# EasyEDA Pro project ProPrj_fallctf2025badge_2025-09-24.epro, board badge-v0.3
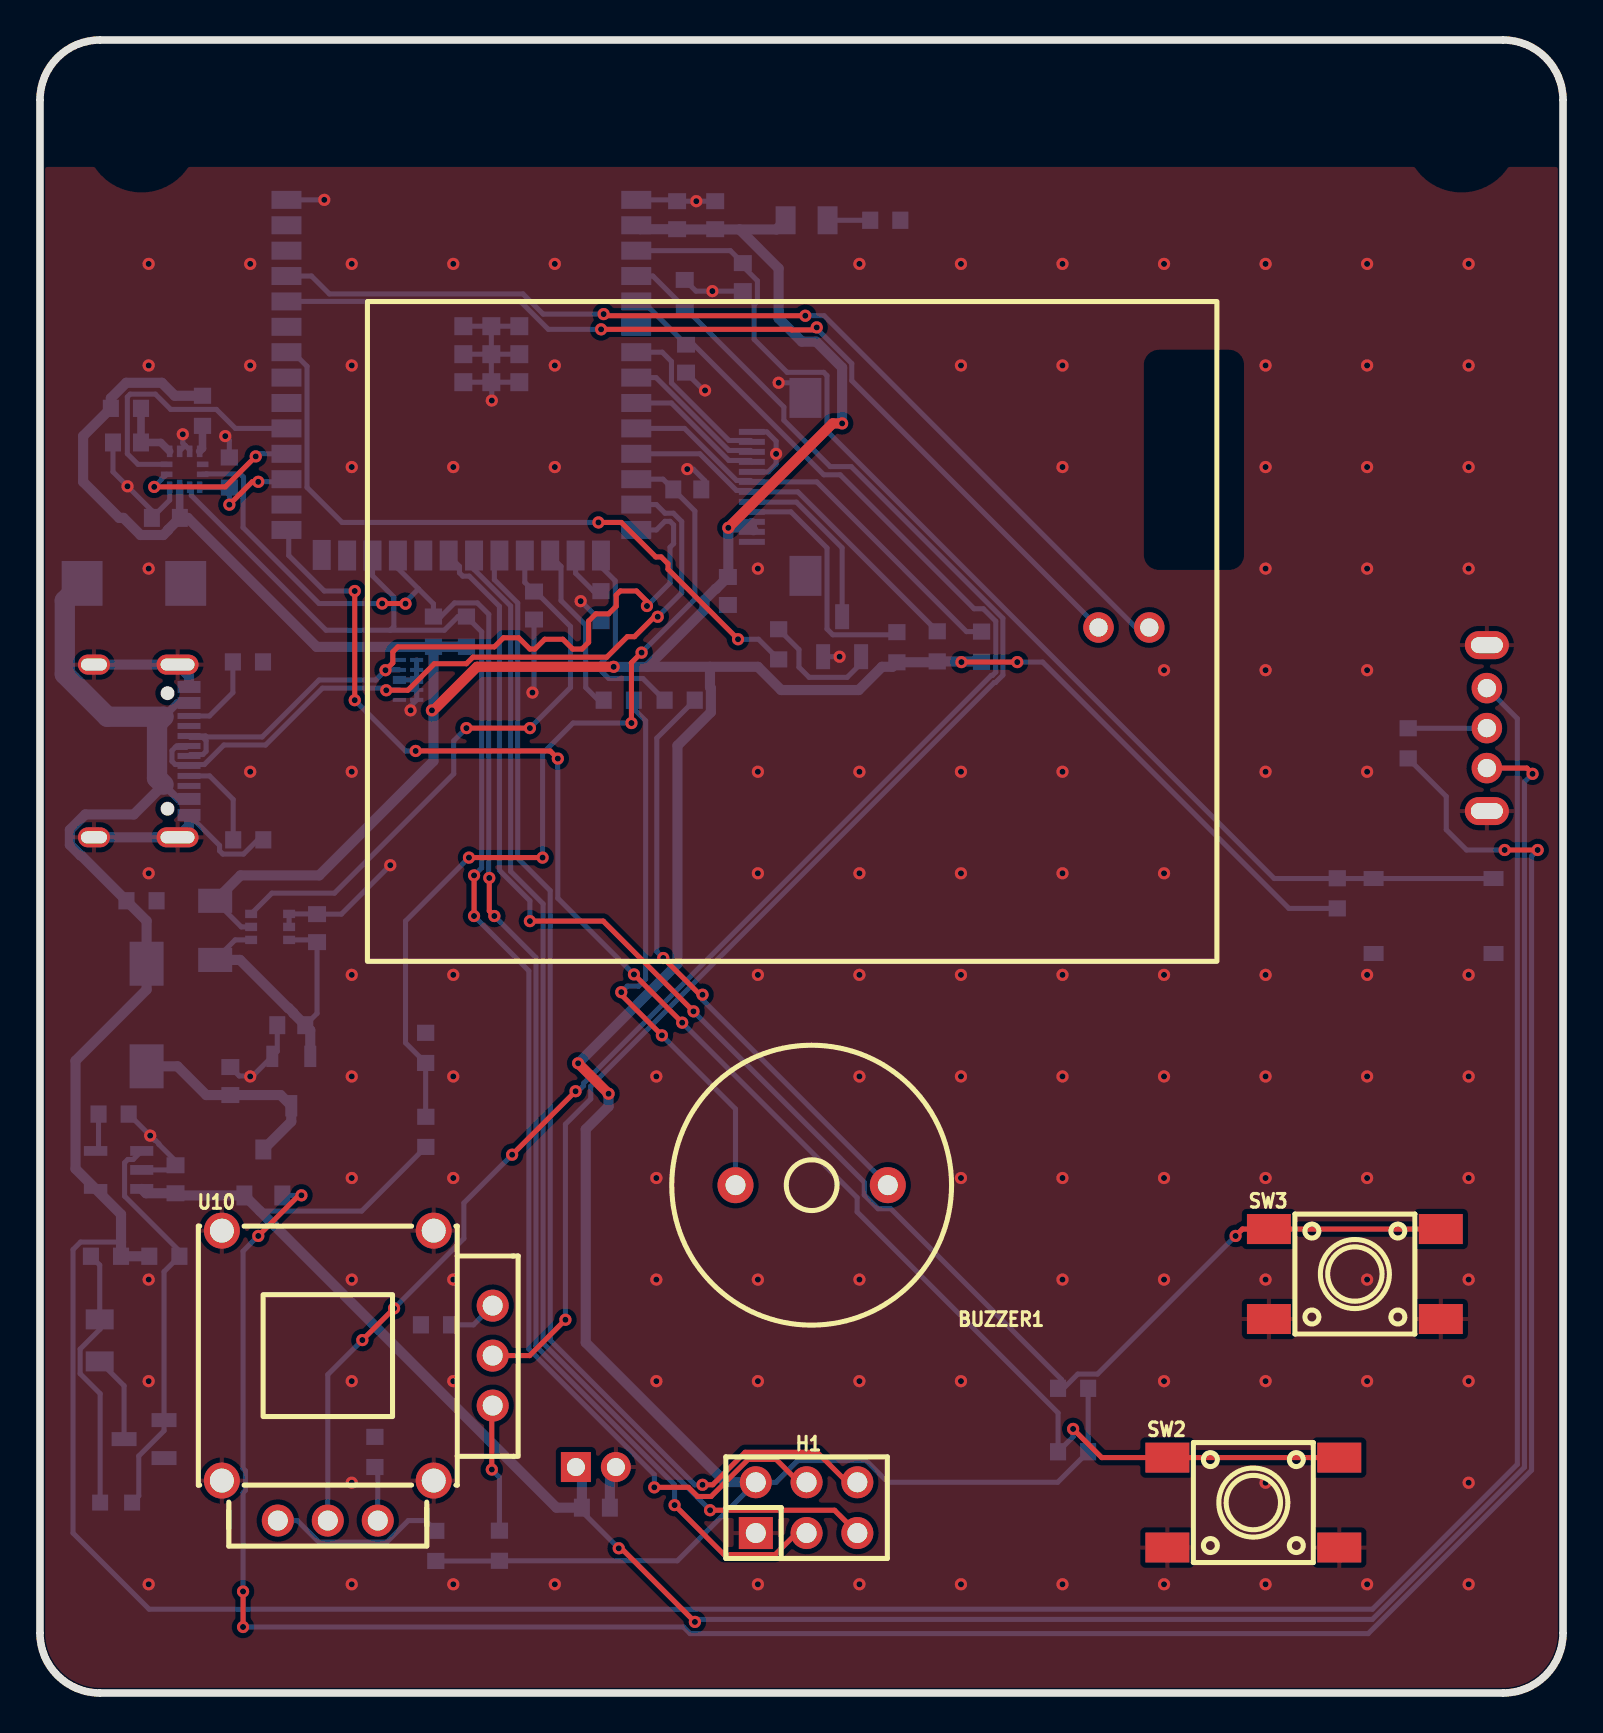
[diagram p17: board, top side]
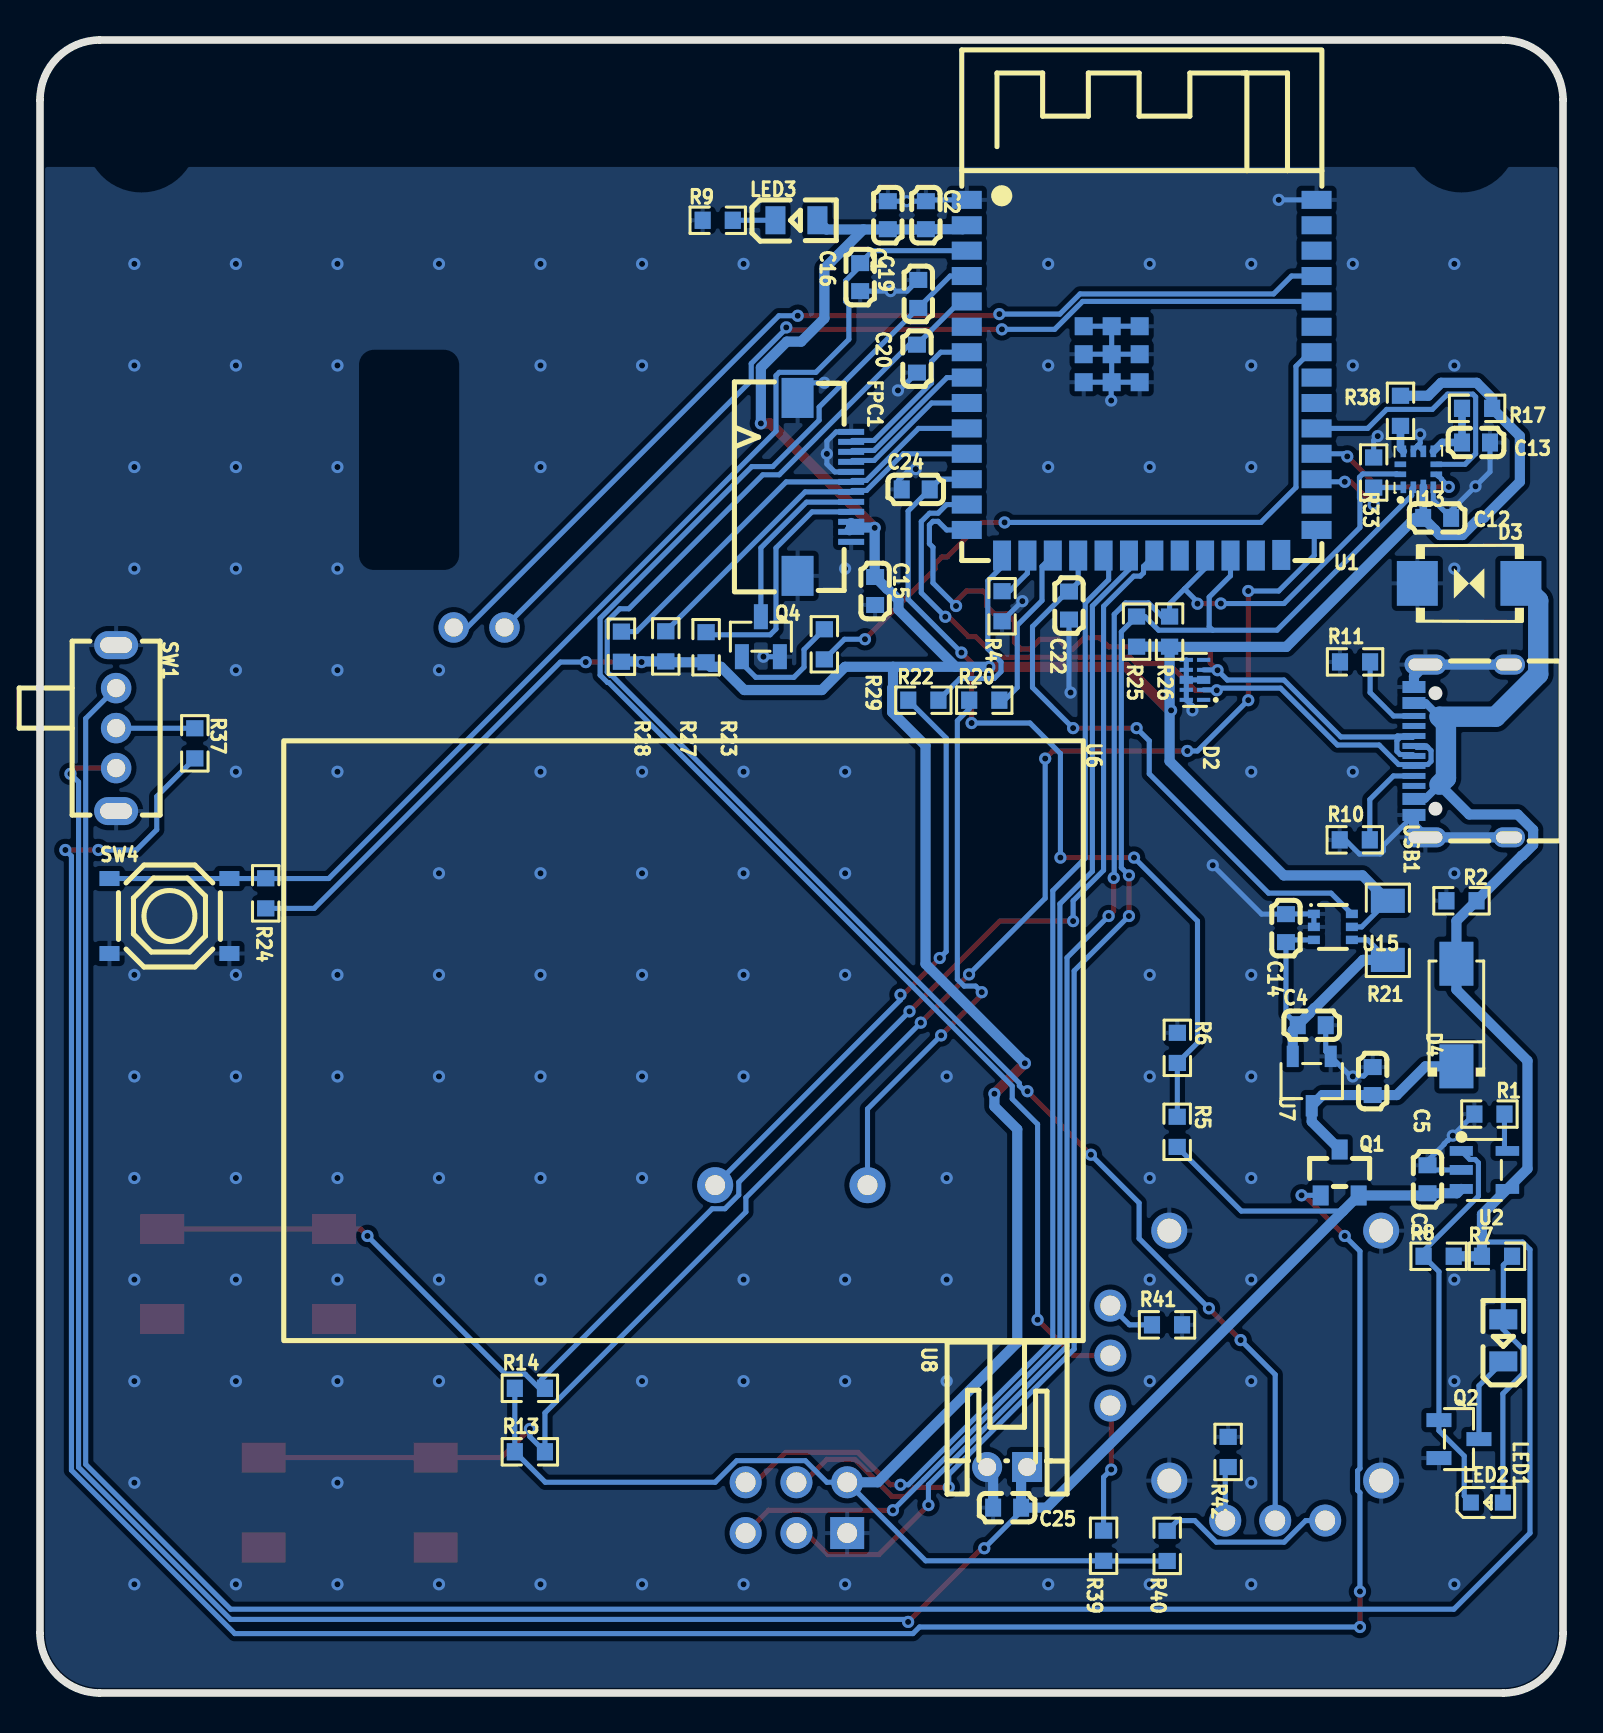
[diagram p18: board, bottom side, seen from below]

Outline 76.2 x 82.68 mm; copper layers: Top Layer, Bottom Layer. Coordinates in mm from the lower left corner of the outline.
Outline path: 0,79.68 0,3 arc(0.88,0.88) 3,0 73.2,0 arc(75.32,0.88) 76.2,3 76.2,79.68 arc(75.32,81.8) 73.2,82.68 3,82.68 arc(0.88,81.8) 0,79.68
Stack: Top Layer 0.035mm / Dielectric1 1.51mm FR4 er 4.5 / Bottom Layer 0.035mm

## Design rules (mm)
net D+: DP1
net D-: DP1
template: Custom Config
spacing copperThickness1oz (default): track to track 0.102, other pairs 0.152 to 0.3
spacing copperThickness2oz: track to track 0.203, other pairs 0.152 to 0.3
track width copperThickness1oz (default): min 0.127, default 0.254, max 2.54
track width copperThickness2oz: min 0.203, default 0.254, max 2.54
differential pair differentialPair (default): width min 0.127, default 0.254, max 2.54; gap min 0.152, default 0.152
via viaSize (default): diameter min 0.45, default 0.61, max 10; hole min 0.3, default 0.305, max 6.3

## Placement (name value [footprint] x y rotation side)
BUZZER1  4kHz  [BUZ-TH_BD14.0-P7.60-D0.7]  38.61 25.4 0 top
C1  22uF  [C0603]  33.78 73.91 90 bottom
C2  100nF  [C0603]  31.88 73.91 90 bottom
C3  1uF  [C0603]  6.78 25.7 90 bottom
C4  1uF  [C0603]  12.57 33.4 180 bottom
C5  1uF  [C0603]  9.53 30.61 90 bottom
C12  1uF  [C0603]  6.3 58.77 180 bottom
C13  1uF  [C0603]  4.35 62.55 180 bottom
C14  100nF  [C0603]  13.86 38.26 90 bottom
C15  100nF  [C0603]  34.42 55.12 270 bottom
C16  1uF  [C0603]  35.16 70.82 270 bottom
C19  100nF  [C0603]  32.26 69.98 270 bottom
C20  100nF  [C0603]  32.32 66.74 90 bottom
C22  100nF  [C0603]  24.72 54.39 90 bottom
C24  100nF  [C0603]  32.38 60.2 180 bottom
C25  100nF  [C0603]  27.81 9.27 0 bottom
D2  H5VU25U  [DFN2510-10_L2.5-W1.0-P0.50-BL]  18.41 50.67 90 bottom
D3  P6SMB6.8CA/TR13  [SMB_L4.6-W3.6-LS5.3-BI]  4.7 55.5 180 bottom
D4  SS14  [SMA_L4.2-W2.6-LS5.3-RD]  5.33 33.91 90 bottom
FPC1  AFC01-S12FCA-00  [FPC-SMD_AFC01-S12FCA-00]  36.96 60.32 270 bottom
H1  PM2.54-2*3  [HDR-TH_6P-P2.54-V-F-R2-C3-S2.54]  38.35 9.27 0 top
LED1  KT-0805G  [LED0805-R-RD]  2.99 17.64 90 bottom
LED2  KT-0603R  [LED0603-RD]  3.81 9.52 180 bottom
LED3  KT-0805G  [LED0805-R-RD]  38.35 73.66 180 bottom
Q1  AO3401A  [SOT-23_L2.9-W1.3-P1.90-LS2.4-BR]  11.18 26.03 270 bottom
Q2  AO3400A  [SOT-23-3_L2.9-W1.3-P1.90-LS2.4-BR]  5.21 12.7 0 bottom
Q4  AO3400A  [SOT-23-3_L2.9-W1.3-P1.90-LS2.4-BR]  40.13 52.83 270 bottom
R1  2.2K  [R0603]  3.68 28.96 0 bottom
R2  10K  [R0603]  5.08 39.62 180 bottom
R4  10K  [R0603]  28.07 54.36 90 bottom
R5  100K  [R0603]  19.3 28.07 270 bottom
R6  100K  [R0603]  19.3 32.27 270 bottom
R7  22K  [R0603]  3.3 21.84 0 bottom
R8  10K  [R0603]  6.22 21.84 180 bottom
R9  8.2K  [R0603]  42.29 73.66 180 bottom
R10  5K1  [R0603]  10.42 42.67 180 bottom
R11  5K1  [R0603]  10.41 51.57 180 bottom
R13  10K  [R0603]  51.69 12.06 180 bottom
R14  10K  [R0603]  51.69 15.24 180 bottom
R17  33  [R0603]  4.3 64.25 180 bottom
R20  220  [R0603]  28.96 49.66 0 bottom
R21  100mΩ  [R1206]  8.77 38.14 90 bottom
R22  220  [R0603]  32 49.66 0 bottom
R23  10  [R0603]  42.87 52.31 90 bottom
R24  10K  [R0603]  64.91 40 270 bottom
R25  5K1  [R0603]  21.34 53.09 270 bottom
R26  5K1  [R0603]  19.69 53.09 270 bottom
R27  10K  [R0603]  44.89 52.35 270 bottom
R28  10K  [R0603]  47.11 52.33 270 bottom
R29  220  [R0603]  36.96 52.45 90 bottom
R33  10K  [R0603]  9.47 61.04 270 bottom
R37  33  [R0603]  68.45 47.5 270 bottom
R38  10K  [R0603]  8.13 64.13 90 bottom
R39  8.2K  [R0603]  22.99 7.37 90 bottom
R40  8.2K  [R0603]  19.8 7.36 90 bottom
R41  820  [R0603]  19.81 18.41 180 bottom
R42  820  [R0603]  16.76 12.06 90 bottom
SW1  SK12D07VG4  [SW-TH_SK12D07VG4]  72.39 48.26 270 bottom
SW2  TS-1102S-C-C-B  [KEY-SMD_4P-L6.0-W6.0-P4.50-LS8.6]  60.71 9.52 0 top
SW3  TS-1102S-C-C-B  [KEY-SMD_4P-L6.0-W6.0-P4.50-LS8.6]  65.79 20.95 0 top
SW4  TS-1187A-B-A-B  [SW-SMD_4P-L5.1-W5.1-P3.70-LS6.5-TL_H1.5]  69.72 38.86 0 bottom
U1  2.4GHz  [WIRELM-SMD_ESP32-S3-WROOM-1]  21.08 65.79 180 bottom
U2  TP4054-42-SOT25R  [SOT-23-5_L3.0-W1.7-P0.95-LS2.8-BL]  3.94 26.16 270 bottom
U3  -  [pad_THT]  55.5 53.29 180 bottom
U4  -  [pad_THT]  52.96 53.29 180 bottom
U6  Battery  [lipo_battery]  45.34 32.64 270 bottom
U7  XC6206P332MR-G  [SOT-23-3_L2.9-W1.6-P1.90-LS2.8-BR]  12.57 30.61 90 bottom
U8  S2B-PH-K(LF)(SN)  [CONN-TH_S2B-PH-K-LF-SN]  27.81 11.3 180 bottom
U10  YA13-FL7.4-B5Ka(45-10)-R-Y06  [RES-ADJ-TH_YA13-FL7.4-B5KA-45-10-R-Y06_1]  15.88 15.88 0 top
U13  STK8321  [LGA-12_L2.0-W2.0-P0.50-TR]  7.24 61.2 0 bottom
U15  INA199A1DCKR  [SC-70-6_L2.2-W1.3-P0.65-LS2.1-BR]  11.51 38.32 0 bottom
U16  DISPLAY  [ER-TFT018-3]  38.1 53.72 0 top
USB1  HC-TYPE-C-16P-01A-L  [USB-C-SMD_G-SWITCH_GT-USB-7010EN]  5.08 47.12 90 bottom

## Footprints (pads in the part's own frame, mm; a bottom-side part is the same pattern mirrored in y, then rotated)
BUZ-TH_BD14.0-P7.60-D0.7
  round 1.8 hole 1: 1(-3.81,0) 2(3.81,0)
C0603
  rect 0.8x0.9 smd: 1(-0.7,0) 2(0.7,0)
CONN-TH_S2B-PH-K-LF-SN
  rect 1.5x1.5 hole 0.9: 1(1,0)
  round 1.5 hole 0.9: 2(-1,0)
DFN2510-10_L2.5-W1.0-P0.50-BL
  rect 0.2x0.665 smd: 1(-1,-0.433) 2(-0.5,-0.433) 4(0.5,-0.433) 5(1,-0.433) 6(1,0.433) 7(0.5,0.433) 9(-0.5,0.433) 10(-1,0.433)
  rect 0.4x0.665 smd: 3(0,-0.433) 8(0,0.433)
FPC-SMD_AFC01-S12FCA-00
  rect 0.3x1.3 smd: 1(-2.751,1.341) 2(-2.251,1.341) 3(-1.751,1.341) 4(-1.25,1.341) 5(-0.75,1.341) 6(-0.249,1.341) 7(0.251,1.341) 8(0.75,1.341) 9(1.249,1.341) 10(1.75,1.341) 11(2.249,1.341) 12(2.75,1.341)
  rect 2x1.6 smd: 13(-4.45,-1.34) 14(4.45,-1.341)
HDR-TH_6P-P2.54-V-F-R2-C3-S2.54
  rect 1.7x1.6 hole 1: 1(-2.54,-1.27)
  round 1.6 hole 1: 2(-2.54,1.27) 3(0,-1.27) 4(0,1.27) 5(2.54,-1.27) 6(2.54,1.27)
KEY-SMD_4P-L6.0-W6.0-P4.50-LS8.6
  rect 2.2x1.5 smd: 1(-4.3,2.25) 2(4.3,2.25) 3(-4.3,-2.25) 4(4.3,-2.25)
LED0603-RD
  rect 0.8x0.8 smd: 1(-0.799,0) 2(0.799,0)
LED0805-R-RD
  rect 1x1.399 smd: 1(1.05,0) 2(-1.05,0)
LGA-12_L2.0-W2.0-P0.50-TR
  rect 0.28x0.58 smd: 1(0.75,0.9) 2(0.25,0.9) 4(-0.75,0.9) 7(-0.75,-0.9) 8(-0.25,-0.9) 9(0.25,-0.9) 10(0.75,-0.9)
  rect 0.28x0.67 smd: 3(-0.25,0.855)
  rect 0.58x0.28 smd: 5(-0.9,0.25) 6(-0.9,-0.25) 11(0.9,-0.25) 12(0.9,0.25)
pad_THT
  round 1.524 hole 0.914: 1(0,0)
R0603
  rect 0.806x0.864 smd: 1(-0.753,0) 2(0.753,0)
R1206
  rect 1.208x1.701 smd: 1(-1.479,0) 2(1.479,0)
RES-ADJ-TH_YA13-FL7.4-B5KA-45-10-R-Y06_1
  round 1.6 hole 1: 1(6.775,3.5) 2(6.775,1) 3(6.775,-1.5) 4(1.025,-7.25) 5(-1.475,-7.25) 6(-3.975,-7.25)
  round 1.8 hole 1.2: 7(3.825,7.25) 7(3.825,-5.25) 8(-6.775,7.25) 8(-6.775,-5.25)
SC-70-6_L2.2-W1.3-P0.65-LS2.1-BR
  rect 0.6x0.42 smd: 1(0.95,-0.65) 2(0.95,0) 3(0.95,0.65) 4(-0.95,0.65) 5(-0.95,0) 6(-0.95,-0.65)
SMA_L4.2-W2.6-LS5.3-RD
  rect 2.2x1.7 smd: 1(-2.566,0) 2(2.566,0)
SMB_L4.6-W3.6-LS5.3-BI
  rect 2.047x2.241 smd: 1(-2.591,0) 2(2.591,0)
SOT-23-3_L2.9-W1.3-P1.90-LS2.4-BR
  rect 1.25x0.7 smd: 1(1,-0.95) 2(1,0.95) 3(-1,0)
SOT-23-3_L2.9-W1.6-P1.90-LS2.8-BR
  rect 1.07x0.6 smd: 1(1.235,-0.95) 2(1.235,0.95) 3(-1.235,0)
SOT-23-5_L3.0-W1.7-P0.95-LS2.8-BL
  rect 0.49x1.157 smd: 1(-0.95,-1.153) 2(0,-1.153) 3(0.95,-1.153)
  rect 0.49x1.175 smd: 4(0.95,1.153) 5(-0.95,1.153)
SOT-23_L2.9-W1.3-P1.90-LS2.4-BR
  rect 1x0.8 smd: 1(1.15,-0.95) 2(1.15,0.95) 3(-1.15,0)
SW-SMD_4P-L5.1-W5.1-P3.70-LS6.5-TL_H1.5
  rect 1x0.75 smd: 1(-3,1.875) 2(3,1.875) 3(-3,-1.875) 4(3,-1.875)
SW-TH_SK12D07VG4
  round 1.524 hole 0.914: 1(-2,0) 2(0,0) 3(2,0)
  oval 1.4x2.2 hole 0.8x1.6: 4(4.15,0) 5(-4.15,0)
USB-C-SMD_G-SWITCH_GT-USB-7010EN
  oval 1x2.1 hole 0.6x1.7: 1(-4.32,1.802) 2(4.32,1.802)
  oval 1x1.6 hole 0.6x1.3: 3(4.32,-2.377) 4(-4.32,-2.377)
  rect 0.6x1.15 smd: A1B12(-3.2,2.377) A4B9(-2.4,2.377) B1A12(3.2,2.377) B4A9(2.4,2.377)
  rect 0.3x1.15 smd: A5(-1.25,2.377) A6(-0.25,2.377) A7(0.25,2.377) A8(1.25,2.377) B5(1.75,2.377) B6(0.75,2.377) B7(-0.75,2.377) B8(-1.75,2.377)
WIRELM-SMD_ESP32-S3-WROOM-1
  rect 1.5x0.9 smd: 1(-8.75,8.895) 2(-8.75,7.625) 3(-8.75,6.355) 4(-8.75,5.085) 5(-8.75,3.815) 6(-8.75,2.545) 7(-8.75,1.275) 8(-8.75,0.005) 9(-8.75,-1.265) 10(-8.75,-2.535) 11(-8.75,-3.805) 12(-8.75,-5.075) 13(-8.75,-6.345) 14(-8.75,-7.615) 27(8.75,-7.615) 28(8.75,-6.345) 29(8.75,-5.075) 30(8.75,-3.805) 31(8.75,-2.535) 32(8.75,-1.265) 33(8.75,0.005) 34(8.75,1.275) 35(8.75,2.545) 36(8.75,3.815) 37(8.75,5.085) 38(8.75,6.355) 39(8.75,7.625) 40(8.75,8.895)
  rect 0.9x1.5 smd: 15(-6.985,-8.895) 16(-5.715,-8.895) 17(-4.445,-8.895) 18(-3.175,-8.895) 19(-1.905,-8.895) 20(-0.635,-8.895) 21(0.635,-8.895) 22(1.905,-8.895) 23(3.175,-8.895) 24(4.445,-8.895) 25(5.715,-8.895) 26(6.985,-8.865)
  rect 0.9x0.9 smd: 41(-2.9,-0.225) 41(-2.9,1.175) 41(-2.9,2.575) 41(-1.5,-0.225) 41(-1.5,1.175) 41(-1.5,2.575) 41(-0.1,-0.225) 41(-0.1,1.175) 41(-0.1,2.575)

## Nets
As in the schematic.

Pads without a net: D2 1 5; U1 6 22 25 26 28 32 33 35 38 39; U13 11; USB1 A8 B8

## Via types
v1: diameter 0.61, hole 0.305, Top Layer to Bottom Layer, 201 vias

## Routing (per net, layer and track width the routed paths; a pad name or vN(x,y) marks a point on that pad's centre or on a via; arc(x,y) is an arc through that point)
+3.3V: length 236.2
  Top Layer w0.254: v1(48.9,51.56) v1(46.1,51.56)
  Top Layer w0.508: v1(34.44,58.28) 39.66,63.5 v1(40.13,63.5) ; v1(28.7,51.33) 21.86,51.33 19.69,49.15 ; v1(26.92,31.5) v1(28.45,29.97)
  Bottom Layer w0.254: 64.91,39.24 62.48,39.24 50.16,51.56 v1(48.9,51.56) ; U15.5 10.07,38.32 R21.2 ; R14.1 R13.1 50.92,10.54 42.42,10.54 41.34,11.62 37.91,11.62 36.83,10.54 H1.2 31.89,6.61 R39.1 22.98,6.6 R40.1 ; 46.08,51.56 46.05,51.6
  Bottom Layer w0.381: U13.3 6.99,58.78
  Bottom Layer w0.508: 35,73.2 36.96,71.25 36.96,68.75 38.12,67.59 38.84,67.59 40.13,66.29 v1(40.13,63.5) ; 35,73.2 31.89,73.2 31.87,73.21 30.03,73.21 U1.2 ; 35,73.2 36.84,73.2 LED3.1 ; 33.52,51.33 35.92,51.33 37.08,50.16 40.96,50.16 42.12,51.33 42.65,51.33 R23.1 44.85,51.55 R27.2 47.09,51.6 47.11,51.58 ; 33.52,51.33 33.52,50.3 33.57,50.26 33.57,49.06 31.89,47.38 31.89,36.47 v1(26.92,31.5) ; 33.52,51.33 30.39,51.33 ; H1.2 34.29,10.54 27.31,17.53 27.31,28.19 28.45,29.34 v1(28.45,29.97) ; 30.39,51.33 33.25,54.18 33.25,54.67 33.8,55.22 33.82,55.22 C15.1 34.44,55.84 v1(34.44,58.28) 34.45,58.29 35.56,58.29 ; 30.39,51.33 v1(28.7,51.33) ; 35.56,58.29 35.62,58.35 35.62,58.52 ; 35.56,58.29 35.7,58.16 ; R26.2 19.69,46.61 13.97,40.89 10.03,40.89 R21.2 ; R26.2 19.68,52.32 13.84,52.32 7.39,58.77 C12.1 6.41,58.18 6.41,58.16 6.17,57.92 5.03,57.92 4.17,58.77 3.96,58.77 2.16,60.58 2.16,62.87 R17.2 3.55,64.76 4.32,65.53 6.1,65.53 6.75,64.88 R38.2 ; R26.2 R25.2
  vias: v1(19.61,49.15)
+5V: length 182.9
  Bottom Layer w0.254: 4.06,22.55 2.03,22.55 1.65,22.18 1.65,8 5.46,4.19 66.67,4.19 73.91,11.44 73.91,48.74 SW1.1
  Bottom Layer w0.381: USB1.B4A9 6.87,49.52 6.18,48.83 ; USB1.A4B9 6.9,44.72 6.18,45.43
  Bottom Layer w0.508: R8.2 R7.2 4.06,23.94 U2.4 1.78,26.22 1.78,31.62 5.33,35.18 D4.2 5.33,38.62 R2.2 2.06,41.89 2.03,41.89 1.5,42.42 1.5,43.17 2.27,43.94 4.69,43.94 6.18,45.43
  Bottom Layer w1.016: 6.18,48.83 5.86,48.5 5.86,45.76 6.18,45.43 ; D3.2 1.24,54.63 1.24,50.96 3.37,48.83 6.16,48.83
GND: length 83.3
  Bottom Layer w0.254: U1.41 U1.41 ; U1.41 U1.41 ; U1.41 U1.41 ; U1.41 22.61,65.54 v1(22.61,64.64) ; D2.8 D2.9 D2.10 18.54,49.37 v1(18.54,49.15) ; D2.8 D2.7 D2.6 ; D2.8 D2.3 ; C20.1 33.21,65.15 v1(33.27,65.15) ; U1.41 U1.41 ; U1.41 U1.41 ; U1.41 U1.41 ; U1.40 v1(14.22,74.68) ; R1.2 v1(5.51,27.88) 5.76,27.64 5.78,27.64 5.95,27.47 5.95,27.44 6.78,26.61 C3.2 6.55,26.16 U2.2 ; 7.27,62.39 7.49,62.17 U13.9 ; 7.27,62.39 7.25,62.39 6.99,62.13 U13.8 ; 7.27,62.39 7.14,62.51 v1(7.14,62.96) ; FPC1.1 36.37,63.08 36.83,62.61 v1(36.83,61.98) 36.83,61.47 36.44,61.07 FPC1.5 ; U1.41 U1.41 ; U1.41 U1.41 ; USB1.A1B12 8.98,42.39 8.98,42.12 9.15,41.96 10.19,41.96 10.9,42.67 R10.1 ; U1.1 31.81,74.68 C2.2 v1(32.84,74.61) C1.2 ; v1(27.05,54.61) 27.06,54.61 R4.1 ; C24.1 33.26,60.38 33.26,60.63 32.68,61.21 v1(32.38,61.21) ; v1(24.64,50.04) 24.72,50.12 C22.1 ; Q4.2 v1(40,51.83) ; U13.4 6.49,59.66 C12.2 5.6,59.13 v1(4.38,60.35) 3.65,61.08 C13.2 ; C19.1 32.82,70.12 v1(33.64,70.12) C16.2 ; v1(9.27,62.86) 9.47,62.66 R33.1 ; U15.2 U15.1 13.85,38.97 C14.2 15.08,38.96 v1(17.53,41.4) ; v1(36.96,65.53) 38.15,65.53 38.48,65.21 38.48,64.95 FPC1.13 ; C5.2 9.97,30.86 10.64,30.86 11.87,32.09 C4.2
  Bottom Layer w0.508: U8.2 28.51,11 C25.2 ; USB1.B1A12 7.46,50.86 USB1.2 USB1.3 ; 2.7,42.8 6.88,42.8 7.46,43.37 USB1.A1B12
  vias: v1(5.44,71.48) v1(5.44,66.4) v1(5.44,56.24) v1(5.44,41) v1(5.44,20.68) v1(5.44,15.6) v1(5.44,5.44) v1(10.52,71.48) v1(10.52,66.4) v1(10.52,46.08) v1(10.52,30.84) v1(15.6,71.48) v1(15.6,66.4) v1(15.6,61.32) v1(15.6,46.08) v1(15.6,35.92) v1(15.6,30.84) v1(15.6,25.76) v1(15.6,20.68) v1(15.6,15.6) v1(15.6,10.52) v1(15.6,5.44) v1(20.68,71.48) v1(20.68,61.32) v1(20.68,35.92) v1(20.68,30.84) v1(20.68,25.76) v1(20.68,20.68) v1(20.68,15.6) v1(20.68,5.44) v1(25.76,71.48) v1(25.76,66.4) v1(25.76,61.32) v1(25.76,5.44) v1(30.84,30.84) v1(30.84,25.76) v1(30.84,20.68) v1(30.84,15.6) v1(35.92,56.24) v1(35.92,46.08) v1(35.92,41) v1(35.92,35.92) v1(35.92,20.68) v1(35.92,15.6) v1(35.92,5.44) v1(41,71.48) v1(41,46.08) v1(41,41) v1(41,35.92) v1(41,30.84) v1(41,20.68) v1(41,15.6) v1(41,5.44) v1(46.08,71.48) v1(46.08,66.4) v1(46.08,46.08) v1(46.08,41) v1(46.08,35.92) v1(46.08,30.84) v1(46.08,25.76) v1(46.08,15.6) v1(46.08,5.44) v1(51.16,71.48) v1(51.16,66.4) v1(51.16,61.32) v1(51.16,46.08) v1(51.16,41) v1(51.16,35.92) v1(51.16,30.84) v1(51.16,25.76) v1(51.16,20.68) v1(51.16,5.44) v1(56.24,71.48) v1(56.24,51.16) v1(56.24,41) v1(56.24,35.92) v1(56.24,30.84) v1(56.24,25.76) v1(56.24,20.68) v1(56.24,15.6) v1(56.24,5.44) v1(61.32,71.48) v1(61.32,66.4) v1(61.32,61.32) v1(61.32,56.24) v1(61.32,51.16) v1(61.32,46.08) v1(61.32,35.92) v1(61.32,30.84) v1(61.32,25.76) v1(61.32,20.68) v1(61.32,15.6) v1(61.32,10.52) v1(61.32,5.44) v1(66.4,71.48) v1(66.4,66.4) v1(66.4,61.32) v1(66.4,56.24) v1(66.4,51.16) v1(66.4,46.08) v1(66.4,35.92) v1(66.4,30.84) v1(66.4,25.76) v1(66.4,20.68) v1(66.4,15.6) v1(66.4,5.44) v1(71.48,71.48) v1(71.48,66.4) v1(71.48,61.32) v1(71.48,56.24) v1(71.48,35.92) v1(71.48,30.84) v1(71.48,25.76) v1(71.48,20.68) v1(71.48,15.6) v1(71.48,10.52) v1(71.48,5.44)
VBAT: length 130.5
  Top Layer w0.254: v1(28.96,7.24) 29.08,7.11 29.21,7.11 v1(32.77,3.56) ; v1(74.68,45.97) 74.39,46.26 SW1.3
  Bottom Layer w0.254: R5.2 16.1,24.11 11,24.11 ; v1(74.68,45.97) 74.27,45.57 74.27,11.29 66.66,3.68 32.89,3.68 v1(32.77,3.56) ; C25.1 27.11,9.08 v1(28.96,7.24)
  Bottom Layer w0.508: U2.3 5.31,25 C3.1 6.89,24.88 Q1.2 25.84,9.27 C25.1 27.11,11 U8.1
ACCEL1: length 8.2
  Top Layer w0.254: v1(10.8,61.85) 9.27,60.32 v1(5.72,60.32)
  Bottom Layer w0.254: v1(5.72,60.32) 5.72,60.33 6.07,60.68 6.07,60.71 6.23,60.87 6.26,60.87 U13.5 ; v1(10.8,61.85) 10.93,61.98 U1.30
ACCEL2: length 13.8
  Bottom Layer w0.254: U13.6 4.9,61.45 4.37,61.98 4.37,64.82 4.51,64.96 5.77,64.96 6.54,64.2 8.82,64.2 9.77,63.25 U1.31
ACCEL_SA0: length 5.7
  Top Layer w0.254: v1(9.47,59.44) 10.62,60.58 v1(10.92,60.58)
  Bottom Layer w0.254: v1(10.92,60.58) 12.2,60.58 U1.29 ; U13.1 8,60.29 R33.2 v1(9.47,59.44)
BACKLT: length 8.9
  Bottom Layer w0.254: FPC1.8 35.63,59.56 37.85,59.56 40.13,57.28 Q4.3
BTN0: length 82.6
  Top Layer w0.254: v1(15.75,55.12) v1(15.75,49.66) ; v1(29.72,35.94) v1(32.13,33.53) ; SW2.2 SW2.1 53.12,11.77 v1(51.69,13.21) ; v1(25.91,46.74) 25.53,47.12 v1(18.8,47.12)
  Bottom Layer w0.254: v1(29.72,35.94) 25.91,39.75 v1(25.91,46.74) ; U1.27 12.45,58.06 12.45,56.9 14.22,55.12 v1(15.75,55.12) ; v1(32.13,33.53) 40.88,24.78 40.88,24.06 50.94,14.01 R13.2 51.69,12.82 v1(51.69,13.21) ; v1(15.75,49.66) 18.29,47.12 v1(18.8,47.12)
BTN1: length 79.6
  Top Layer w0.254: SW3.2 SW3.1 60.16,23.2 v1(59.82,22.86) ; v1(32.7,34.09) 28.18,38.61 v1(24.51,38.61)
  Bottom Layer w0.254: v1(24.51,38.61) 24.51,39.62 22.99,41.15 22.99,54.35 21.48,55.86 21.15,55.86 20.99,56.03 20.99,56.35 U1.21 ; v1(59.82,22.86) 52.91,15.95 51.92,15.95 51.21,15.24 R14.2 51.12,15.42 51.12,15.67 42.57,24.22 41.93,24.22 41.24,24.91 41.24,25.55 v1(32.7,34.09)
BUZZ: length 10.1
  Bottom Layer w0.254: R22.1 30.17,50.74 28.46,50.74 28.12,51.08 28.12,51.57 28.78,52.23 28.78,55.63 28.07,56.34 U1.15
BUZZVOL: length 8.5
  Bottom Layer w0.254: U1.17 26.07,56.35 26.07,54.64 27.31,53.4 27.31,50.29 27.94,49.66 R20.1
CHG: length 44.2
  Top Layer w0.254: v1(30.1,52.04) 29.59,51.53 v1(29.59,48.51) ; v1(21.46,41.78) v1(25.15,41.78)
  Bottom Layer w0.254: v1(29.59,48.51) 26.67,48.51 25.15,46.99 v1(25.15,41.78) ; R5.1 19.3,28.83 19.3,31.51 18.29,32.52 18.29,38.61 v1(21.46,41.78) ; v1(30.1,52.04) 32.77,54.7 32.77,59.12 C24.2 31.17,60.71 U1.12
D+: length 38.4
  Top Layer w0.254: v1(17.29,51.16) 17.65,51.52 17.65,52.07 17.91,52.32 22.73,52.32 23.19,52.78 23.95,52.78 24.51,52.21 24.76,52.21 25.26,52.7 26.16,52.7 26.65,52.21 27.11,52.21 27.45,52.55 27.45,53.61 27.81,53.97 28.45,53.97 28.83,54.36 28.83,54.92 29.03,55.12 29.84,55.12 30.37,54.6 v1(30.37,54.37)
  Bottom Layer w0.254: U1.14 30.84,58.17 31.27,58.6 31.52,58.6 31.7,58.42 31.7,57.48 31.52,57.3 31.52,55.52 v1(30.37,54.37) ; D2.4 17.3,51.17 v1(17.29,51.16) 16.8,50.66 13.96,50.66 11.12,47.82 8.33,47.82 8.29,47.87 USB1.B6 7.53,47.8 8.15,47.8 8.31,47.63 8.31,47.1 8.15,46.94 7.53,46.94 USB1.A6
D-: length 38.4
  Top Layer w0.254: v1(17.32,50.15) 18.4,50.15 19.73,51.48 21.33,51.48 21.66,51.81 28.36,51.81 29.38,52.83 29.74,52.83 30.74,53.83 v1(30.91,53.83)
  Bottom Layer w0.254: 7.39,46.44 8.22,46.44 9.2,47.41 11.29,47.41 14.13,50.26 17.22,50.26 v1(17.32,50.15) 17.34,50.17 D2.2 ; 7.39,46.44 USB1.B7 ; 7.39,46.44 6.77,46.44 6.6,46.6 6.6,47.13 6.77,47.3 ; 6.77,47.3 6.84,47.37 USB1.A7 7.44,47.34 7.36,47.34 7.31,47.3 6.77,47.3 ; U1.13 30.84,59.44 31.27,59.01 31.69,59.01 32.11,58.59 32.11,55.03 v1(30.91,53.83)
EN: length 59.6
  Bottom Layer w0.254: U1.3 34.54,72.14 C16.1 35.16,71.36 35.89,70.63 35.89,69.6 35.73,69.44 35.73,67.7 37.38,66.05 39.21,66.05 39.38,65.89 39.38,63.11 61.75,40.74 SW4.3 SW4.4
ISENSE: length 29.2
  Top Layer w0.254: v1(24.51,48.26) v1(21.34,48.26)
  Bottom Layer w0.254: U15.6 11.6,40 14.73,40 20.7,45.97 20.7,47.62 v1(21.34,48.26) ; U1.18 24.26,55.55 C22.2 24.79,55.09 26.54,53.34 26.54,50.29 v1(24.51,48.26)
JS1: length 74.4
  Top Layer w0.254: U10.2 24.5,16.88 v1(26.29,18.67)
  Bottom Layer w0.254: v1(26.29,18.67) 26.29,28.45 27.56,29.72 27.56,30.36 47.74,50.54 47.8,50.54 48.18,50.91 48.18,53.75 40.59,61.34 39.54,61.34 37.22,63.66 37.22,64.32 C19.2 30.66,70.87 29.83,70.87
JS2: length 83.5
  Top Layer w0.254: v1(17.72,19.24) v1(16.13,17.65) ; v1(26.8,30.1) v1(23.62,26.92)
  Bottom Layer w0.254: U10.5 14.4,15.92 v1(16.13,17.65) ; v1(23.62,26.92) 21.21,24.51 21.21,22.73 v1(17.72,19.24) ; v1(26.8,30.1) 26.92,30.1 27.2,30.38 27.2,30.5 47.59,50.9 47.66,50.9 47.82,51.06 47.82,53.6 47.19,54.23 46.74,54.23 40.03,60.93 39.21,60.93 32.7,67.44 C20.2 30.16,69.6 U1.5
LCD_CMD: length 8.3
  Bottom Layer w0.254: FPC1.2 35.55,62.65 34.47,62.65 31.59,65.52 31.59,66.6 31.13,67.06 U1.7
LCD_CS: length 21.5
  Bottom Layer w0.254: U1.10 32.25,63.25 34.85,60.65 35.54,60.65 FPC1.6 38.87,60.57 46.35,53.09 R28.1
LCD_LED: length 34.7
  Top Layer w0.254: v1(27.94,58.55) 29.08,58.55 30.81,56.82 31.08,56.82 31.42,56.48 31.42,56.21 v1(34.93,52.7)
  Bottom Layer w0.254: v1(27.94,58.55) 15.11,58.55 13.36,60.3 13.36,66.36 12.66,67.06 U1.34 ; R29.1 35.95,52.7 v1(34.93,52.7)
LCD_RST: length 18.7
  Bottom Layer w0.254: R27.1 37.92,60.07 FPC1.7 35.54,60.15 34.85,60.15 33.01,61.98 U1.11
NCHRG: length 20.2
  Bottom Layer w0.254: U2.1 4.66,26.69 4.4,26.69 4.23,26.52 4.23,24.85 6.98,22.11 R8.1 6.21,21.07 Q2.1 6.21,13.12 4.94,11.86 4.94,9.86 LED2.1
PRE_3V3: length 15.6
  Bottom Layer w0.254: C4.1 13.86,33.99 C14.1 13.75,37.67 U15.3 ; R21.1 9.77,37.67 U15.4
  Bottom Layer w0.508: R21.1 10.01,36.67 12.42,34.26 12.44,34.26 12.68,34.02 12.68,33.99 C4.1 13.52,33.15 U7.2
SAO1: length 60.2
  Top Layer w0.254: H1.6 40.39,10.54 38.89,12.04 35.28,12.04 33.66,10.41 v1(33.15,10.41)
  Bottom Layer w0.254: v1(33.15,10.41) 32.76,10.41 25.53,17.64 25.53,40.13 23.9,41.76 23.9,54.52 22.73,55.69 22.73,56.64 U1.19
SAO2: length 60.5
  Top Layer w0.254: v1(33.53,9.14) 39.75,9.14 H1.5
  Bottom Layer w0.254: U1.20 21.72,56.2 23.55,54.37 23.55,41.1 25.17,39.47 25.17,17.5 31.98,10.69 v1(33.53,9.14)
SCL: length 78.9
  Top Layer w0.254: v1(18.29,54.48) 18.28,54.49 v1(17.12,54.49) ; v1(31.75,9.4) 34.23,6.92 36.78,6.92 37.86,8 H1.3 ; v1(22.73,38.86) 22.48,39.12 v1(22.48,40.77)
  Bottom Layer w0.254: v1(18.29,54.48) 18.29,54.57 18.94,55.22 ; U13.12 8.3,60.95 8.32,60.97 10.02,60.97 10.19,60.81 10.19,59.77 10.16,59.75 10.16,58.29 13.96,54.49 v1(17.12,54.49) ; v1(22.48,40.77) 22.45,40.79 22.45,53.95 21.88,54.52 20.74,54.52 20.06,53.84 R26.1 19.69,54.47 18.94,55.22 ; 18.94,55.22 17.91,56.25 U1.23 ; v1(31.75,9.4) 31.75,10.41 24.81,17.35 24.81,36.78 v1(22.73,38.86)
SCL2: length 7.3
  Bottom Layer w0.254: FPC1.3 35.54,62.15 34.47,62.15 30.82,65.79 U1.8
SDA: length 78.3
  Top Layer w0.254: H1.4 37.97,10.54 36.83,11.68 35.43,11.68 33.58,9.83 32.91,9.83 32.45,10.29 v1(30.73,10.29) ; v1(21.72,40.89) v1(21.72,38.86)
  Bottom Layer w0.254: v1(21.72,40.89) 22.1,41.27 22.1,53.08 R25.1 20.91,53.84 20.23,53.16 17.53,53.16 ; v1(21.72,38.86) 24.46,36.12 24.46,17.2 30.73,10.93 v1(30.73,10.29) ; U1.24 16.64,55.88 17.7,54.81 17.7,53.33 17.53,53.16 ; U13.2 7.57,60.22 7.57,59.9 14.31,53.16 17.53,53.16
SDA2: length 7
  Bottom Layer w0.254: U1.9 31.59,64.52 34.46,61.65 35.54,61.65 FPC1.4
$1N7837: length 4.2
  Bottom Layer w0.254: R11.2 9.65,50.04 8.48,48.87 USB1.B5
$1N7842: length 4.7
  Bottom Layer w0.254: USB1.A5 8.49,45.87 9.67,44.69 R10.2
$1N22902: length 1.9
  Bottom Layer w0.254: U2.5 2.93,27.26 R1.1
$1N23592: length 2.5
  Bottom Layer w0.254: U1.16 26.8,56.01 27.69,55.11 R4.2
$1N41964: length 48
  Top Layer w0.254: v1(28.07,68.2) 37.58,68.2 37.61,68.17 38.74,68.17 v1(38.86,68.3)
  Bottom Layer w0.254: v1(28.07,68.2) 25.43,68.2 24.04,69.6 U1.36 ; v1(38.86,68.3) 38.86,68.25 40.62,66.49 40.62,65.64 U4.1
$1N50730: length 13.3
  Bottom Layer w0.254: LED2.2 3.01,14.97 2.01,15.97 2.01,17.2 3.01,18.2 3.01,18.67 LED1.1 2.99,21.4 R7.1
$1N50901: length 4.4
  Bottom Layer w0.254: Q2.3 4.21,15.37 LED1.2
$1N51117: length 2.1
  Bottom Layer w0.254: LED3.2 R9.2
$1N58369: length 50.4
  Top Layer w0.254: v1(28.2,68.97) 28.28,68.89 v1(38.29,68.88)
  Bottom Layer w0.254: U3.1 54.82,53.29 39.23,68.88 v1(38.29,68.88) ; v1(28.2,68.97) 25.17,68.97 24.16,69.98 14.48,69.98 13.58,70.87 12.33,70.87
$1N59276: length 132.4
  Top Layer w0.254: v1(10.92,22.86) 12.95,24.89 v1(13.08,24.89) ; v1(10.16,3.3) v1(10.16,5.08) ; v1(73.28,42.16) v1(74.93,42.16)
  Bottom Layer w0.254: v1(13.08,24.89) 12.13,24.89 Q1.1 ; v1(10.16,3.3) 32.19,3.3 32.52,2.97 66.45,2.97 74.63,11.14 74.63,41.86 v1(74.93,42.16) ; v1(10.92,22.86) 10.16,22.1 10.16,11.23 10.28,11.11 10.28,10.14 10.16,10.02 v1(10.16,5.08) ; R37.2 70.36,44.84 70.36,43.18 71.37,42.16 v1(73.28,42.16)
$1N59306: length 3.9
  Bottom Layer w0.254: SW1.2 72.38,48.25 R37.1
$1N59516: length 10.8
  Bottom Layer w0.508: Q1.3 12.57,28.58 U7.3 12.04,29.91 C5.1 8.32,29.91 6.88,31.34 D4.1
$2N18802: length 3.3
  Bottom Layer w0.381: 5.05,64.25 C13.1 6.05,62.55 U13.7
$2N23538: length 1.3
  Bottom Layer w0.381: R38.1 8.13,62.25 U13.10
$2N23979: length 6.4
  Top Layer w0.254: U10.3 22.61,14.33 v1(22.61,11.18)
  Bottom Layer w0.254: v1(22.61,11.18) 22.99,10.79 R39.2
$2N24005: length 9
  Bottom Layer w0.254: 19.8,8.11 19.29,8.62 18.43,8.62 17.35,7.55 13.95,7.55 12.87,8.62 U10.6
$2N24083: length 2.5
  Bottom Layer w0.254: U10.1 21.69,18.41 R41.1
$2N24109: length 2.7
  Bottom Layer w0.254: U10.4 16.9,11.16 R42.1
$3N4890: length 29.9
  Top Layer w0.254: v1(31.18,36.76) 33.02,34.92 v1(33.15,34.92)
  Bottom Layer w0.254: v1(31.18,36.76) 30.86,37.08 30.86,47.76 R22.2 ; BUZZER1.2 33.15,34.67 v1(33.15,34.92)
$3N9223: length 6.3
  Bottom Layer w0.254: Q4.1 41.08,51.5 40.39,50.8 38.48,50.8 37.97,51.31 37.97,52.19 R29.2
$3N12560: length 27.7
  Top Layer w0.254: v1(29.08,35.05) 29.08,34.92 v1(31.12,32.89)
  Bottom Layer w0.254: v1(29.08,35.05) 29.39,35.36 29.96,35.36 30.3,35.7 30.3,48.63 29.71,49.22 R20.2 ; v1(31.12,32.89) 34.8,29.21 BUZZER1.1
$3N15384: length 12.2
  Bottom Layer w0.254: FPC1.9 37.57,59.08 39.38,57.27 39.38,53.22 39.67,52.93 42.74,52.93 R23.2

## Copper pours and planes (outline as drawn; the poured copper is in the pictures)
GND on Top Layer: -3.81,78.61 78.23,78.61 78.23,-2.54 -3.81,-2.54
GND on Bottom Layer: -4.32,77.85 81.53,77.85 81.53,-2.54 -4.32,-2.54
